# EAGLE design SiLabs2TC (EAGLE 7.4.0)
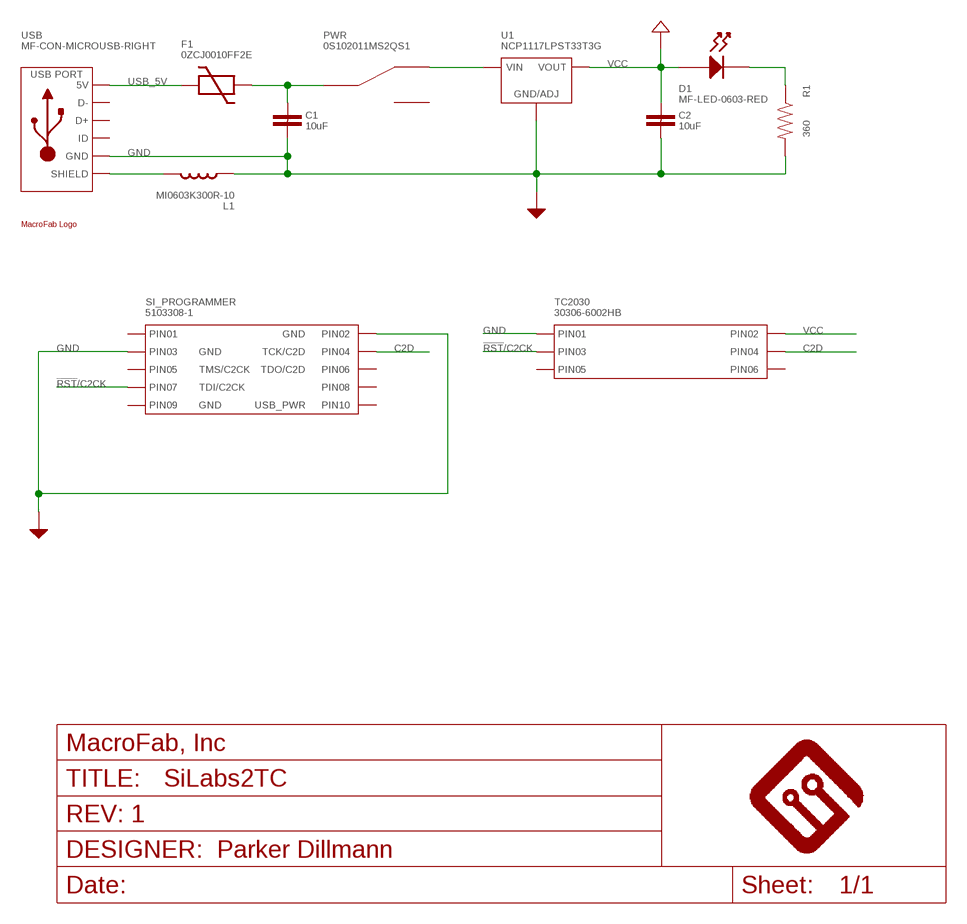
[diagram p0: schematic, sheet 1]

## Parts
C1  10uF  CAPACITOR_NON_POLAR_1206  [1206]
C2  10uF  CAPACITOR_NON_POLAR_1206  [1206]
D1  MF-LED-0603-RED  LED_SINGLE_0805  [LED0805]
F1  0ZCJ0010FF2E  PTC_FUSE_1206  [1206]
FRAME1  MF_FRAMEDEFAULT  [MF_FRAME_DEFAULT]
L1  MI0603K300R-10  INDUCTOR_0603  [L0603]
PWR  0S102011MS2QS1  SPDT_0S102011MS2QS1  [0S102011MS2QS1]
R1  360  RESISTOR_0805  [R0805]
SI_PROGRAMMER  5103308-1  CON_02X05_5103308-1  [5103308-1]
TC2030  30306-6002HB  CON_02X03_30306-6002HB  [30306-6002HB]
U1  NCP1117LPST33T3G  [SOT-223-3]
U$3  MF_LOGOLOGO_MEDIUM  [MF_LOGO_MEDIUM]
USB  MF-CON-MICROUSB-RIGHT  USB_MICRO_RIGHT  [MICROUSB-RIGHT]

## Nets
!RST!/C2CK: SI_PROGRAMMER.7(PIN7) TC2030.3(PIN3)
C2D: SI_PROGRAMMER.4(PIN4) TC2030.4(PIN4)
GND: C1.2 C2.2 L1.P$1 R1.P$2 SI_PROGRAMMER.2(PIN2) SI_PROGRAMMER.3(PIN3) TC2030.1(PIN1) U1.P$2(GND/ADJ) USB.5(GND)
N$1: D1.CATHODE R1.P$1
N$2: C1.1 F1.2 PWR.2(C)
N$4: L1.P$2 USB.S1(SLD) USB.S2(SLD) USB.S3(SLD) USB.S4(SLD) USB.S5(SLD) USB.S6(SLD)
N$5: PWR.1 U1.P$4(VIN)
USB_5V: F1.1 USB.1(5V)
VCC: C2.1 D1.ANODE TC2030.2(PIN2) U1.P$1(VOUT) U1.P$3(VOUT)
Unconnected: PWR.3 SI_PROGRAMMER.1(PIN1) SI_PROGRAMMER.5(PIN5) SI_PROGRAMMER.6(PIN6) SI_PROGRAMMER.8(PIN8) SI_PROGRAMMER.9(PIN9) SI_PROGRAMMER.10(PIN10) TC2030.5(PIN5) TC2030.6(PIN6) USB.2(D-) USB.3(D+) USB.4(ID)

## Library data of the parts
C1 C2 = PP_Passives:CAPACITOR_NON_POLAR: Capacitor Non Polarized
D1 = MF_LEDs:LED_SINGLE: Library: MF_LEDs Description: Device for Single LED Packages. Manufacture part number (MFG#) can be added via Attributes.
F1 = PP_Passives:PTC_FUSE
FRAME1 = MF_Aesthetics:MF_FRAME: Library: MF_Aesthetics Description: Frame for adding Meta Data to the PCB and Schematic.; DNAME: Parker Dillmann; REVNUM: REV: 1
L1 = MF_Passives:INDUCTOR: Library: MF_Passives Description: Device for Inductors. Manufacture part number (MFG#) can be added via Attributes.; MFG#: N/A
PWR = PP_Electromechanical:SPDT
R1 = MF_Passives:RESISTOR: Library: MF_Passives Description: Device for Resistors. Manufacture part number (MFG#), Voltage, Tolerance, and Wattage Rating can be added via Attributes.; MFG#: N/A; TOLERANCE: N/A; VOLTAGE: N/A; WATTAGE: N/A
SI_PROGRAMMER = PP_Connectors:CON_02X05; LABEL02: GND; LABEL03: GND; LABEL04: TCK/C2D; LABEL05: TMS/C2CK; LABEL06: TDO/C2D; LABEL07: TDI/C2CK; LABEL09: GND; LABEL10: USB_PWR
TC2030 = PP_Connectors:CON_02X03
U1 = MF_IC_Power:NCP1117LP: Manufacturer Part #: NCP1117LP Manufacturer: ON Semiconductor Description: LDO Voltage Regulators
U$3 = PP_Aesthetics:MF_LOGO
USB = MF_Connectors:USB: Library: MF_Connectors Description: 5 Pin USB Connectors. SLD is the shield connection. Usually tied to ground through a small ferrite bead.

## Board
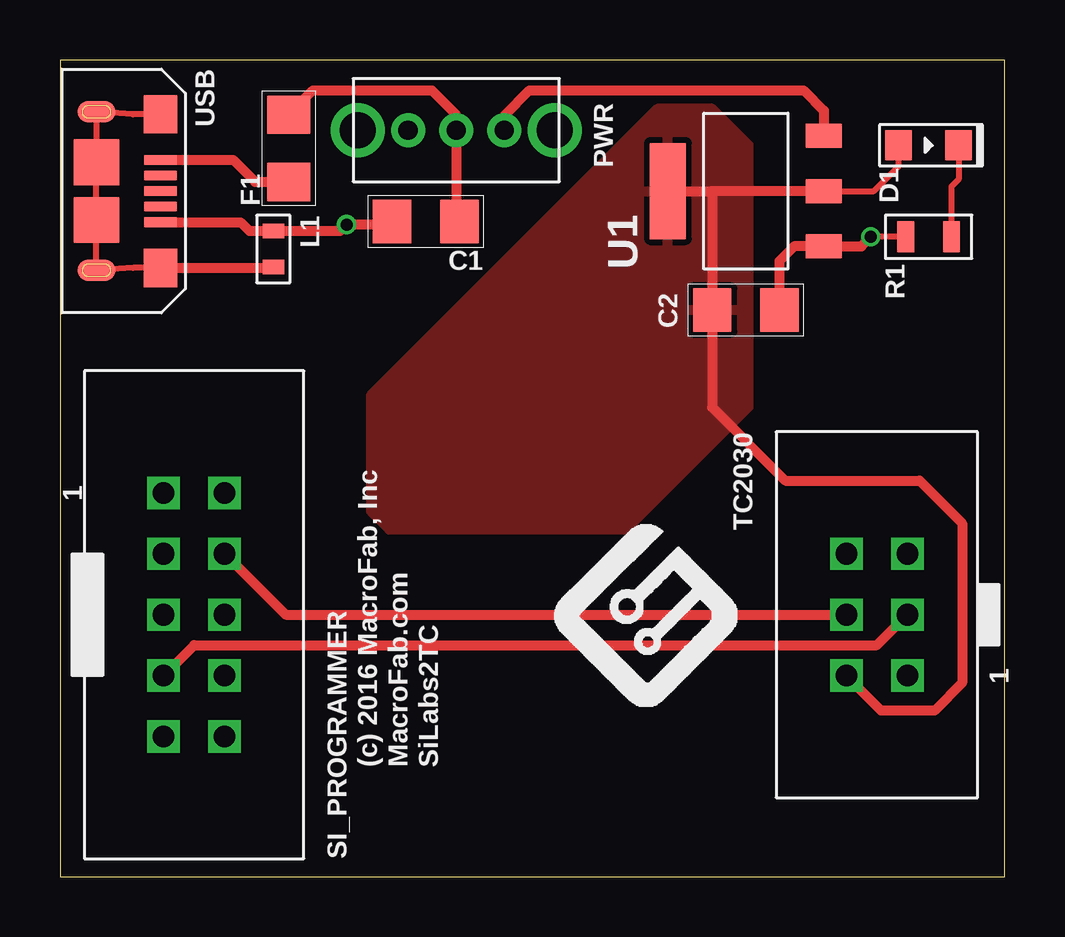
[diagram p1: board, top side]
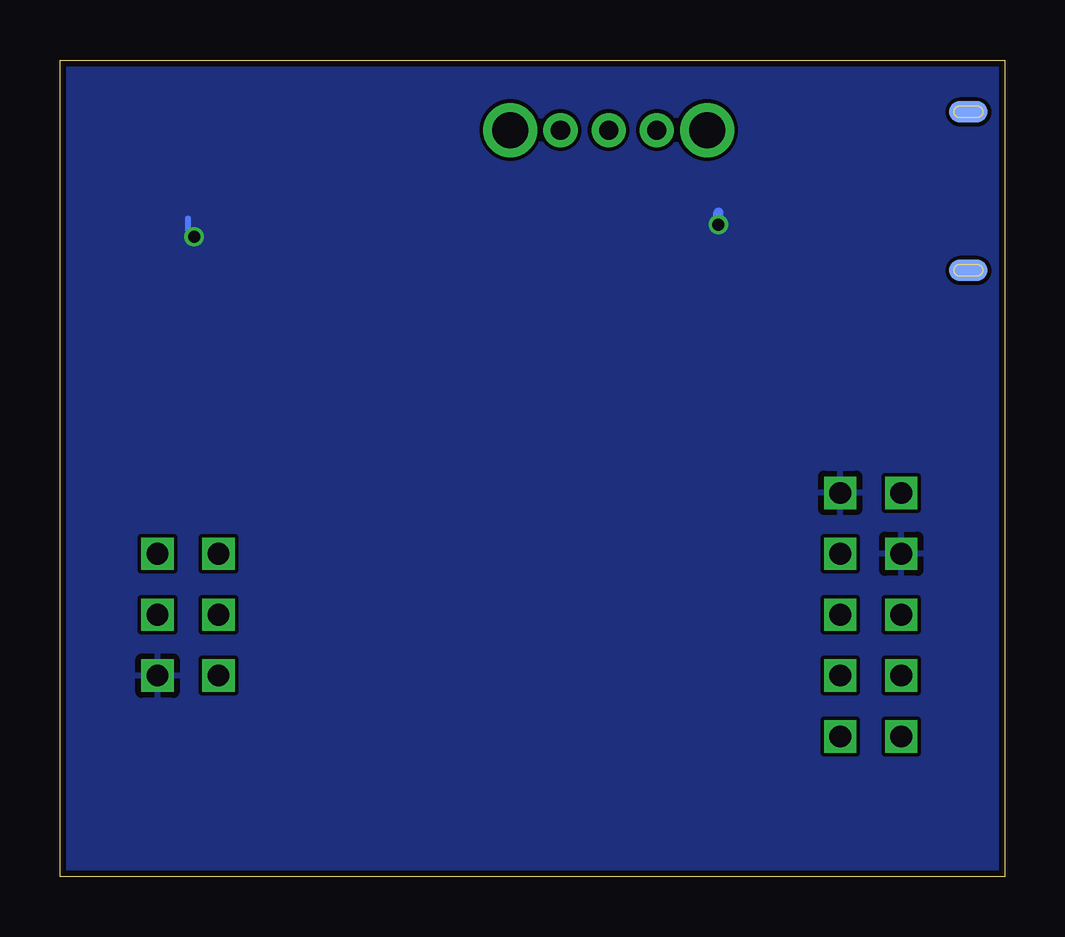
[diagram p2: board, bottom side, seen from below]

Size 39.37 x 34.04 mm. Coordinates in mm from the lower left corner, seen from the top.
Outline: 0,0 39.37,0 39.37,34.04 0,34.04 0,0
Copper layers (1*16): Top 0.035mm / dielectric 1.5mm / Bottom 0.035mm
Design rules "MF_Standard_2_Layer": minimum track width 6mil, minimum drill 12mil, track to track 6mil, track to pad 6mil, pad to pad 6mil, via to via 6mil, smd to smd 0mil, copper to edge 10mil, drill to drill 10mil, minimum pad ring 6mil, minimum via ring 6mil, stop-mask expansion 2mil, vias tented up to drill 25mil, thermal gap 10mil

### Footprints (pad centres in the part's own frame; a part is rotated, then mirrored left to right if it is on the bottom)
1206 = smd 1.6 x 1.8: 1 -1.4,0; 2 1.4,0
LED0805 = smd 1.1 x 1.25: ANODE 1.25,0; CATHODE -1.25,0
L0603 = smd 0.6 x 0.9: P$1 -0.75,0; P$2 0.75,0
0S102011MS2QS1 = drill 0.8 pad 1.422: 1 -2.007,0; 2 0,0; 3 2.007,0 | drill 1.5 pad 2.184: P$4 -4.102,0; P$5 4.102,0
R0805 = smd 0.7 x 1.3: P$1 -0.95,0; P$2 0.95,0
5103308-1 = drill 0.9 square: 1 5.08,1.27; 2 5.08,-1.27; 3 2.54,1.27; 4 2.54,-1.27; 5 0,1.27; 6 0,-1.27; 7 -2.54,1.27; 8 -2.54,-1.27; 9 -5.08,1.27; 10 -5.08,-1.27
30306-6002HB = drill 0.9 square: 1 2.54,1.27; 2 2.54,-1.27; 3 0,1.27; 4 0,-1.27; 5 -2.54,1.27; 6 -2.54,-1.27
SOT-223-3 = smd 4 x 1.5: P$1 0,3.25 | smd 1 x 1.5: P$2 -2.3,-3.25; P$3 0,-3.25; P$4 2.3,-3.25
MICROUSB-RIGHT = smd 0.4 x 1.35: 1 -1.3,1.27; 2 -0.65,1.27; 3 0,1.27; 4 0.65,1.27; 5 1.3,1.27 | smd 0.9 x 1.6: S1 -3.3,-1.4; S2 3.3,-1.4 | smd 1.6 x 1.4: S3 -3.2,1.27; S4 3.2,1.27 | smd 1.9 x 1.9: S5 -1.2,-1.405; S6 1.2,-1.405 | smd 0.9 x 1.6 bottom: S7 -3.3,-1.4; S8 3.3,-1.4

### Placement (x,y rotation side)
C1  15.24,27.3 180 top
C2  28.57,23.62 0 top
D1  36.2,30.48 180 top
F1  9.53,30.35 90 top
FRAME1  11.94,4.57 90 top
L1  8.89,26.16 270 top
PWR  16.51,31.11 180 top
R1  36.2,26.67 180 top
SI_PROGRAMMER  5.59,10.92 90 top
TC2030  34.04,10.92 270 top
U1  28.57,28.57 90 top
U$3  28.19,7.11 90 top
USB  2.92,28.57 270 top

### Tracks (layer width: path | path; a pad name or v marks a point on that pad's centre or on a via)
!RST!/C2CK
  Top 0.406: SI_PROGRAMMER.7 5.59,9.65 34.04,9.65 TC2030.3
C2D
  Top 0.406: SI_PROGRAMMER.4 9.4,10.92 TC2030.4
GND  (via drill 0.5)
  Top 0.254: R1.P$2 v33.78,26.67
  Top 0.406: C1.2 13.84,27.18 v11.94,27.18 11.67,26.91 L1.P$1 7.89,26.91 7.52,27.27 USB.5 | v33.78,26.67 33.39,26.27 U1.P$2 30.59,26.27 29.97,25.65 C2.2
  Bottom 0.254: v33.78,26.67 34.04,26.92 34.04,27.43
  Bottom 0.406: v11.94,27.18 11.94,27.69
  pour Bottom: 0,34.04 39.37,34.04 39.37,0 0,0
N$1
  Top 0.254: D1.CATHODE 37.45,29.06 37.15,28.76 R1.P$1
N$2
  Top 0.406: F1.2 10.54,32.77 15.49,32.77 16.51,31.75 PWR.2 16.51,27.3 C1.1
N$4
  Top 0.254: USB.S4 3.04,25.38 USB.S2 1.52,25.53 USB.S6 USB.S5 USB.S1 3.04,31.77 USB.S3
  Top 0.406: USB.S4 8.85,25.38 L1.P$2
N$5
  Top 0.406: PWR.1 18.54,31.14 18.54,31.75 19.56,32.77 30.99,32.77 31.82,31.93 U1.P$4
USB_5V
  Top 0.406: USB.1 7.21,29.88 8.13,28.95 F1.1
VCC
  Top 0.254: U1.P$3 33.91,28.57 34.95,29.61 D1.ANODE
  Top 0.406: U1.P$1 27.18,28.57 | 27.18,28.57 C2.1 27.18,19.56 30.23,16.51 35.81,16.51 37.59,14.73 37.59,8.08 36.44,6.93 34.22,6.93 TC2030.2 | U1.P$3 27.18,28.57
  pour Top: 24.89,32 12.95,20.07 12.95,15.24 13.72,14.48 23.59,14.48 28.7,19.59 28.7,30.48 27.18,32